# Altium schematic sheet Connect.SchDoc
size A4
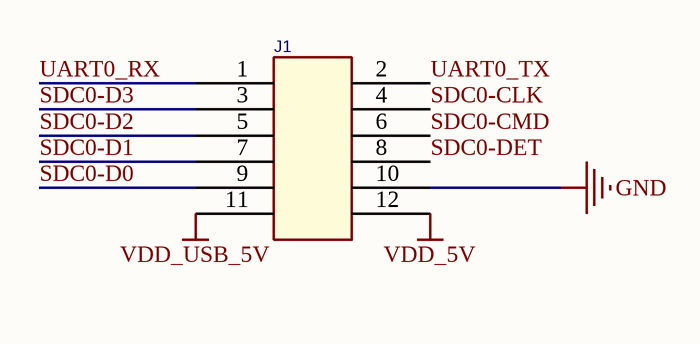
[diagram p0: Connect.SchDoc]

## Parts
J1  MIPI0  [TEST_CORE]  (value not drawn)

## Nets
GND: J1.10
VDD_5V: J1.12
VDD_USB_5V: J1.11
SDC0-CLK: J1.4
SDC0-CMD: J1.6
SDC0-D0: J1.9
SDC0-D1: J1.7
SDC0-D2: J1.5
SDC0-D3: J1.3
SDC0-DET: J1.8
UART0_RX: J1.1
UART0_TX: J1.2

## Library data of the parts
J1 = TEST_12P